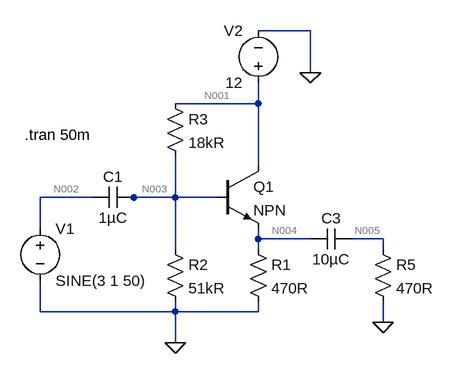
[diagram p0: schematic collector_circuit.asc]
collector_circuit.asc, the LTspice schematic file:
Version 4
SHEET 1 880 680
WIRE 240 -128 160 -128
WIRE 240 -64 240 -128
WIRE 160 -16 160 -48
WIRE 160 -16 32 -16
WIRE 160 80 160 -16
WIRE -96 128 -176 128
WIRE -32 128 -48 128
WIRE 32 128 32 64
WIRE 32 128 -32 128
WIRE 96 128 32 128
WIRE -176 176 -176 128
WIRE 160 192 160 176
WIRE 240 192 160 192
WIRE 352 192 304 192
WIRE 32 208 32 128
WIRE 160 208 160 192
WIRE 352 208 352 192
WIRE -176 304 -176 256
WIRE 32 304 32 288
WIRE 32 304 -176 304
WIRE 160 304 160 288
WIRE 160 304 32 304
WIRE 352 320 352 288
WIRE 32 352 32 304
FLAG 32 352 0
FLAG 240 -64 0
FLAG 352 320 0
SYMBOL npn 96 80 R0
SYMATTR InstName Q1
SYMBOL res 144 192 R0
SYMATTR InstName R1
SYMATTR Value 470R
SYMBOL res 16 192 R0
SYMATTR InstName R2
SYMATTR Value 51kR
SYMBOL res 16 -32 R0
SYMATTR InstName R3
SYMATTR Value 18kR
SYMBOL cap -32 112 R90
WINDOW 0 0 32 VBottom 2
WINDOW 3 32 32 VTop 2
SYMATTR InstName C1
SYMATTR Value 1µC
SYMBOL voltage -176 160 R0
WINDOW 123 0 0 Left 0
WINDOW 39 0 0 Left 0
SYMATTR InstName V1
SYMATTR Value SINE(3 1 50)
SYMBOL voltage 160 -32 R180
WINDOW 0 24 96 Left 2
WINDOW 3 24 16 Left 2
WINDOW 123 0 0 Left 0
WINDOW 39 0 0 Left 0
SYMATTR InstName V2
SYMATTR Value 12
SYMBOL cap 304 176 R90
WINDOW 0 0 32 VBottom 2
WINDOW 3 32 32 VTop 2
SYMATTR InstName C3
SYMATTR Value 10µC
SYMBOL res 336 192 R0
SYMATTR InstName R5
SYMATTR Value 470R
TEXT -200 32 Left 2 !.tran 50m

The netlist it stands for:
* collector_circuit.asc
Q1 N001 N003 N004 0 NPN
R1 N004 0 470R
R2 N003 0 51kR
R3 N001 N003 18kR
C1 N003 N002 1µC
V1 N002 0 SINE(3 1 50)
V2 N001 0 12
C3 N005 N004 10µC
R5 N005 0 470R
.model NPN NPN
.model PNP PNP
.lib standard.bjt
.tran 50m
.backanno
.end

* Results of the author's LTspice run, read from the files saved beside the schematic
* Operating Point, zero values left out:
*   V(n001) = 12 V
*   V(n003) = 7.112 V
*   V(n004) = 6.271 V
*   V(n002) = 3 V
*   Ic(Q1) = 13.21 mA
*   Ib(Q1) = 132.1 µA
*   Ie(Q1) = -13.34 mA
*   I(R3) = 271.6 µA
*   I(R2) = 139.5 µA
*   I(R1) = 13.34 mA
*   I(V2) = -13.48 mA
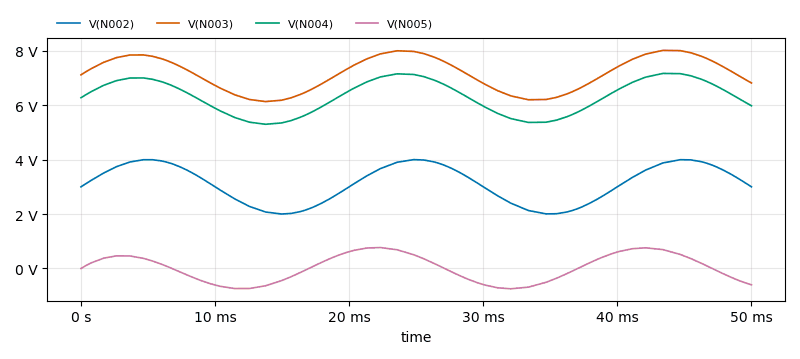
[diagram p1: Transient Analysis of collector_circuit.asc, plotted from the saved traces]
* Transient Analysis, 1 run:
*   V(N002): min 2 V, max 3.998 V, average 3.127 V, rms 3.203 V, last 3 V
*   V(N003): min 6.13 V, max 8.011 V, average 7.167 V, rms 7.195 V, last 6.812 V
*   V(N004): min 5.296 V, max 7.164 V, average 6.326 V, rms 6.357 V, last 5.975 V
*   V(N005): min -746.1 mV, max 769.2 mV, average 27.98 mV, rms 500.8 mV, last -599.7 mV